# EAGLE design button (EAGLE 7.2.0)
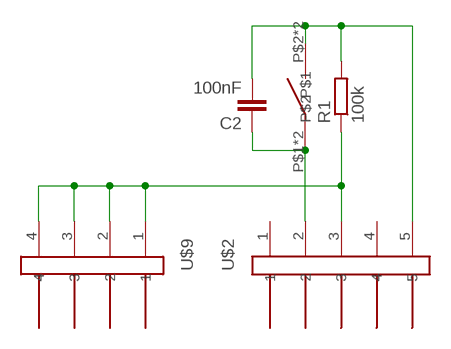
[diagram p0: schematic, sheet 1]

## Parts
C2  100nF  C-EUC0603K  [C0603K]
R1  100k  R-EU_R0603  [R0603]
U$1  BUTTON_6.3X6.3  [BUTTON_6.2X6.2]
U$2  JUMPER5M  [JUMPER5M]
U$9  JUMPER4M  [JUMPER4M]

## Nets
AA: C2.2 R1.2 U$1.P$2 U$1.P$4 U$2.5
GND: R1.1 U$2.3 U$9.1 U$9.2 U$9.3 U$9.4
VCC: C2.1 U$1.P$1 U$1.P$3 U$2.2
Unconnected: U$2.1 U$2.4

## Library data of the parts
C2 = resistor:C-EU: CAPACITOR, European symbol
R1 = resistor:R-EU_: RESISTOR, European symbol
U$1 = !stavebnice03:BUTTON_6.3X6.3
U$2 = !stavebnice03:JUMPER5M
U$9 = !stavebnice03:JUMPER4M

## Net classes
0 default: clearance 0.205 mm

## Board
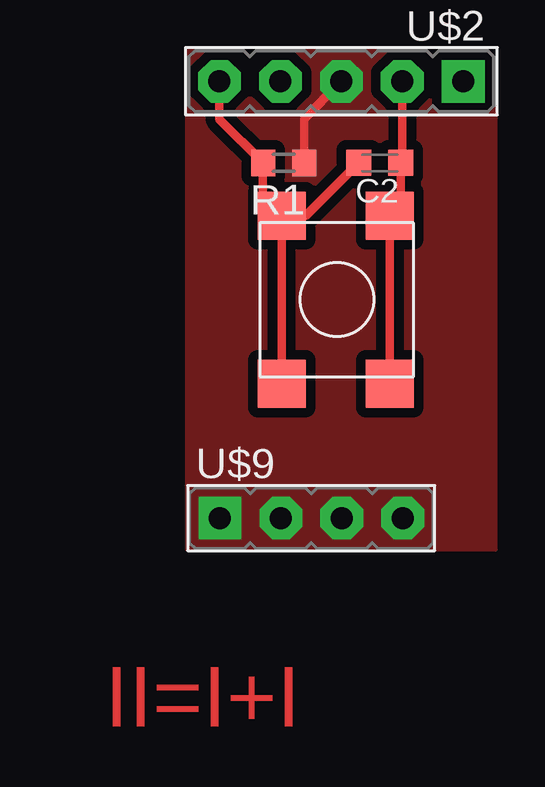
[diagram p1: board, top side]
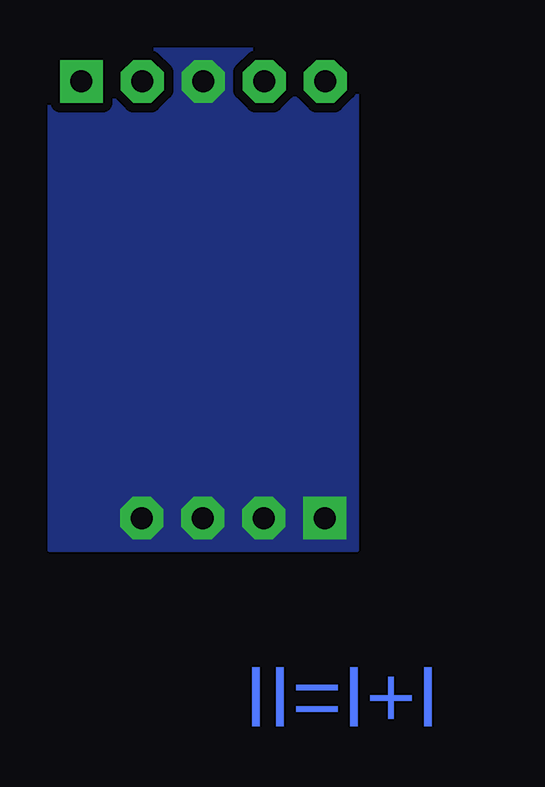
[diagram p2: board, bottom side, seen from below]

No outline drawn. Coordinates in mm, seen from the top.
Copper layers (1*16): Top 0.035mm / dielectric 1.5mm / Bottom 0.035mm
Design rules "default *": minimum track width 10mil, minimum drill 24mil, track to track 8mil, track to pad 8mil, pad to pad 8mil, via to via 8mil, smd to smd 8mil, copper to edge 0mil, drill to drill 1mil, minimum pad ring 10mil, minimum via ring 8mil, stop-mask expansion 4mil, vias tented up to drill 0mil, thermal gap 10mil

### Footprints (pad centres in the part's own frame; a part is rotated, then mirrored left to right if it is on the bottom)
C0603K = smd 1.05 x 1.08: 1 -0.875,0; 2 0.875,0
R0603 = smd 1 x 1.1: 1 -0.85,0; 2 0.85,0
BUTTON_6.2X6.2 = smd 2 x 2: P$1 -2.21,-3.5; P$2 2.29,-3.5; P$3 -2.21,3.5; P$4 2.29,3.5
JUMPER5M = drill 0.914 pad 1.778 square: 1 -5.08,0 | drill 0.914 pad 1.778 octagon: 2 -2.54,0; 3 0,0; 4 2.54,0; 5 5.08,0
JUMPER4M = drill 0.914 pad 1.778 square: 1 -3.81,0 | drill 0.914 pad 1.778 octagon: 2 -1.27,0; 3 1.27,0; 4 3.81,0

### Placement (x,y rotation side)
C2  12.3,16.2 180 top
R1  8.3,16.2 180 top
U$1  10.5,10.5 180 top
U$2  10.7,19.6 180 top
U$9  9.45,1.4 0 top

### Tracks (layer width: path | path; a pad name or v marks a point on that pad's centre or on a via)
AA
  Top 0.356: U$1.P$2 U$1.P$4 8.5,7 | U$1.P$2 7.41,14.06 R1.2 5.62,18.03 U$2.5 | U$1.P$2 9.22,14 C2.2
GND
  Top 0.356: R1.1 9.15,18.05 U$2.3
  pour Bottom (isolate 0.406, rank 2, no thermals): 4.3,0.1 4.3,20.9 17.1,20.9 17.1,0.1
  pour Top (isolate 0.406, rank 2, no thermals): 4.3,0.1 4.3,20.9 17.1,20.9 17.1,0.1
VCC
  Top 0.356: U$1.P$3 U$1.P$1 13.18,14.46 C2.1 13.24,16.27 U$2.2

### Text on the board
Top: II=I+I
Bottom: II=I+I
Dimension: rgb extension